# Altium schematic sheet 12_Periphs.SchDoc: Peripherals
size A3; Organization: Lime Microsystems; Address1: Surrey Tech Centre; Address2: Guildford GU2 7YG; Address3: Surrey; Address4: United Kingdom; Revision: SoDeRa-PCI v1.0; SheetNumber: 12; SheetTotal: 15
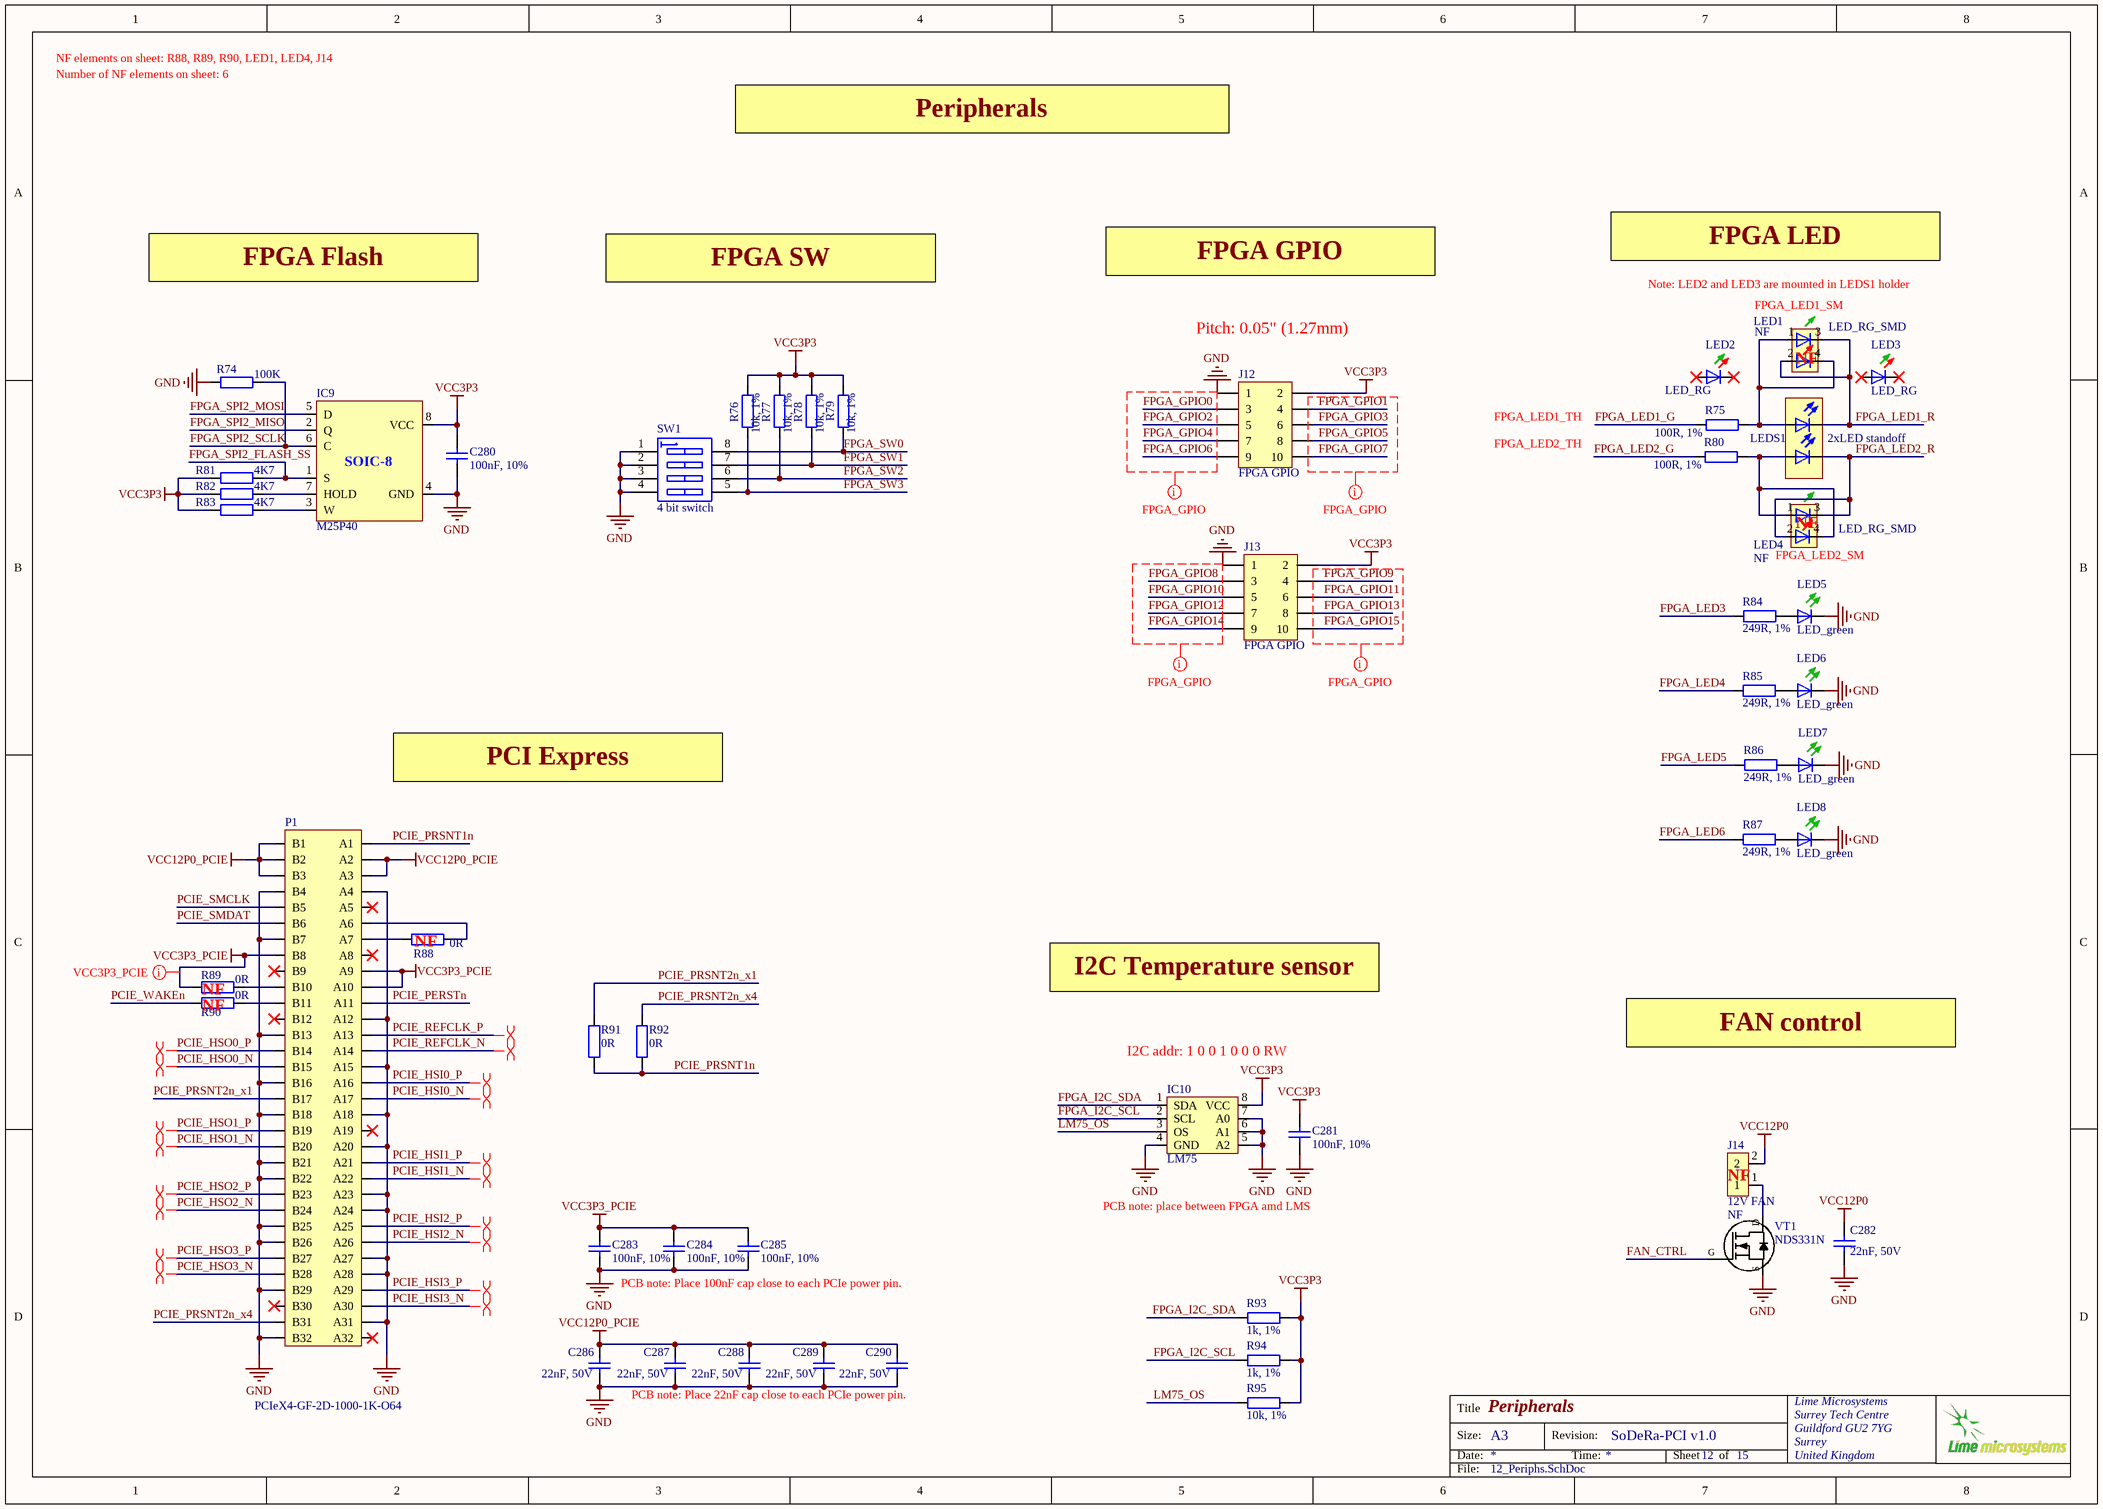
[diagram p0: 12_Periphs.SchDoc]

## Parts
C280  100nF, 10%  [CAP0402]
C281  100nF, 10%  [CAP0402]
C282  22nF, 50V  [CAP0402]
C283  100nF, 10%  [CAP0402]
C284  100nF, 10%  [CAP0402]
C285  100nF, 10%  [CAP0402]
C286  22nF, 50V  [CAP0402]
C287  22nF, 50V  [CAP0402]
C288  22nF, 50V  [CAP0402]
C289  22nF, 50V  [CAP0402]
C290  22nF, 50V  [CAP0402]
IC9  M25P40  [M25P40-VMN6TPB_SO8N]
IC10  LM75  [HWSON8_LM75]
J12  FPGA GPIO  [SWD_10_pin]
J13  FPGA GPIO  [SWD_10_pin]
J14  12V FAN  Assembly Info: NF  [HDR_1x2]
LED1  LED_RG_SMD  Assembly Info: NF  [LED-2x0603]
LED2  LED_RG  (mechanical)
LED3  LED_RG  (mechanical)
LED4  LED_RG_SMD  Assembly Info: NF  [LED-2x0603]
LED5  LED_green  [LED-0603-GREEN]
LED6  LED_green  [LED-0603-GREEN]
LED7  LED_green  [LED-0603-GREEN]
LED8  LED_green  [LED-0603-GREEN]
LEDS1  2xLED standoff  [LED_STANDOFF_H-201C]
P1  PCIeX4-GF-2D-1000-1K-O64  [PCIeX4-GF-2D-1000-1K-O64]  (no BOM)
R74  100K  [RES0402]
R75  100R, 1%  [RES0402]
R76  10k, 1%  [RES0402]
R77  10k, 1%  [RES0402]
R78  10k, 1%  [RES0402]
R79  10k, 1%  [RES0402]
R80  100R, 1%  [RES0402]
R81  4K7  [RES0402]
R82  4K7  [RES0402]
R83  4K7  [RES0402]
R84  249R, 1%  [RES0402]
R85  249R, 1%  [RES0402]
R86  249R, 1%  [RES0402]
R87  249R, 1%  [RES0402]
R88  0R  [RES0402]
R89  0R  [RES0402]
R90  0R  [RES0402]
R91  0R  [RES0402]
R92  0R  [RES0402]
R93  1k, 1%  [RES0402]
R94  1k, 1%  [RES0402]
R95  10k, 1%  [RES0402]
SW1  4 bit switch  [SW_4WAY_SMD_1P27]
VT1  NDS331N  [SOT23-3]

## Nets
GND: C280.2 C281.2 C282.2 C283.2 C284.2 C285.2 C286.2 C287.2 C288.2 C289.2 C290.2 IC9.4(GND) IC10.4(GND) IC10.5(A2) IC10.6(A1) IC10.7(A0) J12.1 J13.1 LED5.K(C) LED6.K(C) LED7.K(C) LED8.K(C) P1.A4 P1.A12 P1.A15 P1.A18 P1.A20 P1.A23 P1.A24 P1.A27 P1.A28 P1.A31 P1.B4 P1.B7 P1.B13 P1.B16 P1.B18 P1.B21 P1.B22 P1.B25 P1.B26 P1.B29 P1.B32 R74.1 SW1.1(A1) SW1.2(A2) SW1.3(A3) SW1.4(A4) VT1.S
VCC3P3: C280.1 C281.1 IC9.8(VCC) IC10.8(VCC) J12.2 J13.2 R76.1 R77.1 R78.1 R79.1 R81.1 R82.1 R83.1 R93.1 R94.1 R95.1
VCC3P3_PCIE: C283.1 C284.1 C285.1 P1.A9 P1.A10 P1.B8 R89.1
VCC12P0: C282.1 J14.2
VCC12P0_PCIE: C286.1 C287.1 C288.1 C289.1 C290.1 P1.A2 P1.A3 P1.B1 P1.B2 P1.B3
FAN_CTRL: VT1.G
FPGA_GPIO0: J12.3
FPGA_GPIO1: J12.4
FPGA_GPIO2: J12.5
FPGA_GPIO3: J12.6
FPGA_GPIO4: J12.7
FPGA_GPIO5: J12.8
FPGA_GPIO6: J12.9
FPGA_GPIO7: J12.10
FPGA_GPIO8: J13.3
FPGA_GPIO9: J13.4
FPGA_GPIO10: J13.5
FPGA_GPIO11: J13.6
FPGA_GPIO12: J13.7
FPGA_GPIO13: J13.8
FPGA_GPIO14: J13.9
FPGA_GPIO15: J13.10
FPGA_I2C_SCL: IC10.2(SCL) R94.2
FPGA_I2C_SDA: IC10.1(SDA) R93.2
FPGA_LED1_G: R75.1
FPGA_LED1_R: LED1.2 LED1.3 LEDS1.K1(C)
FPGA_LED2_G: R80.1
FPGA_LED2_R: LED4.2 LED4.3 LEDS1.K2(C)
FPGA_LED3: R84.1
FPGA_LED4: R85.1
FPGA_LED5: R86.1
FPGA_LED6: R87.1
FPGA_SPI2_FLASH_SS: IC9.1(S) R81.2
FPGA_SPI2_MISO: IC9.2(Q)
FPGA_SPI2_MOSI: IC9.5(D)
FPGA_SPI2_SCLK: IC9.6(C) R74.2
FPGA_SW0: R79.2 SW1.8(B1)
FPGA_SW1: R78.2 SW1.7(B2)
FPGA_SW2: R77.2 SW1.6(B3)
FPGA_SW3: R76.2 SW1.5(B4)
LM75_OS: IC10.3(OS) R95.2
PCIE_HSI0_N: P1.A17
PCIE_HSI0_P: P1.A16
PCIE_HSI1_N: P1.A22
PCIE_HSI1_P: P1.A21
PCIE_HSI2_N: P1.A26
PCIE_HSI2_P: P1.A25
PCIE_HSI3_N: P1.A30
PCIE_HSI3_P: P1.A29
PCIE_HSO0_N: P1.B15
PCIE_HSO0_P: P1.B14
PCIE_HSO1_N: P1.B20
PCIE_HSO1_P: P1.B19
PCIE_HSO2_N: P1.B24
PCIE_HSO2_P: P1.B23
PCIE_HSO3_N: P1.B28
PCIE_HSO3_P: P1.B27
PCIE_PERSTn: P1.A11
PCIE_PRSNT1n: P1.A1 R91.1 R92.1
PCIE_PRSNT2n_x1: P1.B17 R91.2
PCIE_PRSNT2n_x4: P1.B31 R92.2
PCIE_REFCLK_N: P1.A14
PCIE_REFCLK_P: P1.A13
PCIE_SMCLK: P1.B5
PCIE_SMDAT: P1.B6
PCIE_WAKEn: R90.1
NetIC9_3: IC9.3(W) R83.2
NetIC9_7: IC9.7(HOLD) R82.2
NetJ14_1: J14.1 VT1.D
NetLED1_1: LED1.1 LED1.4 LEDS1.A1(A) R75.2
NetLED4_1: LED4.1 LED4.4 LEDS1.A2(A) R80.2
NetLED5_A: LED5.A R84.2
NetLED6_A: LED6.A R85.2
NetLED7_A: LED7.A R86.2
NetLED8_A: LED8.A R87.2
NetP1_A6: P1.A6 R88.2
NetP1_A7: P1.A7 R88.1
NetP1_B10: P1.B10 R89.2
NetP1_B11: P1.B11 R90.2

Not connected (* = marked no-connect by the designer): LED2 A* K(C)*; LED3 A* K(C)*; P1 A5* A8* A19* A32* B9* B12* B30*

## Layout directives
net class FPGA_GPIO: FPGA_GPIO0, FPGA_GPIO1, FPGA_GPIO2, FPGA_GPIO3, FPGA_GPIO4, FPGA_GPIO5, FPGA_GPIO6, FPGA_GPIO7, FPGA_GPIO8, FPGA_GPIO9, FPGA_GPIO10, FPGA_GPIO11, FPGA_GPIO12, FPGA_GPIO13, FPGA_GPIO14, FPGA_GPIO15
differential pair: PCIE_HSI0_N, PCIE_HSI0_P, PCIE_HSI1_N, PCIE_HSI1_P, PCIE_HSI2_N, PCIE_HSI2_P, PCIE_HSI3_N, PCIE_HSI3_P, PCIE_HSO0_N, PCIE_HSO0_P, PCIE_HSO1_N, PCIE_HSO1_P, PCIE_HSO2_N, PCIE_HSO2_P, PCIE_HSO3_N, PCIE_HSO3_P, PCIE_REFCLK_N, PCIE_REFCLK_P
net class VCC3P3_PCIE: VCC3P3_PCIE

## Notes on the sheet
- Number of NF elements on sheet: 6
- NF elements on sheet: R88, R89, R90, LED1, LED4, J14
- Peripherals
- FPGA Flash
- FPGA SW
- FPGA GPIO
- FPGA LED
- (near LED1) Note: LED2 and LED3 are mounted in LEDS1 holder
- (near LED1) FPGA_LED1_SM
- Pitch: 0.05" (1.27mm)
- (near LED1) NF
- FPGA_LED1_TH
- FPGA_LED2_TH
- (near LED4) FPGA_LED2_SM
- (near LED4) NF
- PCI Express
- (near R88) NF
- I2C Temperature sensor
- (near R90) NF
- (near R89) NF
- I2C addr: 1 0 0 1 0 0 0 RW
- FAN control
- (near J14) NF
- PCB note: place between FPGA amd LMS
- PCB note: Place 100nF cap close to each PCIe power pin.
- PCB note: Place 22nF cap close to each PCIe power pin.
- Title
- Size:
- Date:
- A3
- Revision:
- Time:
- Sheet
- of
- File:
- (in symbol M25P40) SOIC-8

## Library data of the parts
C280 C281 = Cap_0603: Manufacturer: Murata; Manufacturer Part Number 1: GRM155R71C104KA88D; Brand: Murata Electronics; Type: General Purpose MLCC; Capacitance: 0.1 uF; Temperature Coefficient / Code: +/- 15 %; Voltage Rating DC: 16 V; Supplier 1: Mouser; Supplier Part Number 1: 81-GRM155R71C104KA88; Tolerance: 10 %; Case Code - in: 0402; Category: Multilayer Ceramic Capacitors MLCC - SMD/SMT; Value: 100nF, 10%; Manufacturer Part Number: GRM155R71C104KA88D
C282 C286-C290 = Cap_0402: Manufacturer: Kemet; Manufacturer Part Number 1: C0402C223K5RACTU; Temperature Coefficient: X7R; Tolerance: ±10%; Capacitance: 0.022µF; Value: 22nF, 50V; Supplier 1: Digi-Key; Supplier Part Number 1: 399-7780-1-ND; Ratings: -; Packaging: Cut Tape (CT); Category: Capacitors; Size / Dimension: 0.039" L x 0.020" W (1.00mm x 0.50mm); RoHS: RoHS Compliant; Operating Temperature: -55°C ~ 125°C; Mounting Type: Surface Mount, MLCC; Applications: General Purpose; Voltage - Rated: 50V; Thickness (Max): 0.022" (0.55mm); Features: -; Height - Seated (Max): -; Lead Style: -; Package / Case: 0402 (1005 Metric); Lead Spacing: -
C283-C285 = Cap_0603: Manufacturer: Murata; Brand: Murata Electronics; Type: General Purpose MLCC; Capacitance: 0.1 uF; Temperature Coefficient / Code: +/- 15 %; Voltage Rating DC: 16 V; Supplier 1: Mouser; Supplier Part Number 1: 81-GRM155R71C104KA88; Tolerance: 10 %; Case Code - in: 0402; Category: Multilayer Ceramic Capacitors MLCC - SMD/SMT; Value: 100nF, 10%
IC9 = M25P40: Manufacturer: Micron Technology Inc; Memory Size: 4M (512K x 8); Voltage - Supply: 2.3 V ~ 3.6 V; Supplier 1: Digi-Key; Supplier Device Package: 8-SO; Supplier: Digi-Key; Supplier Part Number 1: M25P40-VMN6TPBTR-ND
IC10 = LM75: Manufacturer: NXP Semiconductors; Manufacturer Part Number: LM75BTP,147; Sensing Temperature - Local: -55°C ~ 125°C; Output Type: I²C; Accuracy - Highest (Lowest): ±2°C (±3°C); Voltage - Supply: 2.8 V ~ 5.5 V; Test Condition: -25°C ~ 100°C (-55°C ~ 125°C); Sensor Type: Digital, Local; Resolution: 10 b; Supplier 1: Digi-Key; Operating Temperature: -55°C ~ 125°C; Features: Output Switch, Programmable Limit, Shutdown Mode; Supplier Device Package: 8-HWSON (2x3); Sensing Temperature - Remote: -; Category: Sensors, Transducers; Packaging: Tape & Reel (TR); RoHS: RoHS Compliant; Package / Case: 8-WFDFN Exposed Pad; Supplier Part Number 1: 568-9815-2-ND
J12 J13 = Header 5X2_SWD: Header, 5-Pin, Dual row; Manufacturer Part Number 1: M50-3600542; Manufacturer: Harwin Inc; Number of Positions: 10; Molding Height Above Board: 0.039" (1.00mm); Row Spacing: 0.050" (1.27mm); Number of Positions Loaded: All; Connector Type: Unshrouded; Supplier 1: Digi-Key; Contact Mating Length: 0.118" (3.00mm); Category: Connectors, Interconnects; Color: Black; RoHS: RoHS Compliant; Number of Rows: 2; Contact Finish Thickness: 3µin (0.08µm); Height Stacking (Mating): -; Contact Finish: Gold; Termination: Solder; Mounting Type: Surface Mount; Pitch: 0.050" (1.27mm); Features: -; Packaging: Bulk; Supplier Part Number 1: 952-1389-ND
J14 = Jumper: Manufacturer Part Number 1: 961102-6404-AR; Connector Type: Header, Unshrouded; Supplier 1: Digi-Key; Supplier Part Number 1: 3M9447-ND; Contact Type: Male Pin; Color: Black; Mounting Type: Through Hole; Category: Connectors, Interconnects; Contact Finish: Gold
LED1 LED4 = LED_green_red_SMD: Manufacturer Part Number 1: HSMF-C165; Manufacturer: Avago Technologies US Inc.; Millicandela Rating: 15mcd Green, 10mcd Red; Lens Transparency: Diffused; Lens Color: White; Lens Style/Size: Rectangle with Flat Top, 1.60mm x 0.80mm; Wavelength - Peak: 570nm Green, 636nm Red; Wavelength - Dominant: 572nm Green, 621nm Red; Viewing Angle: 120°; Voltage - Forward (Vf) (Typ): 2.2V Green, 1.95V Red; Current - Test: 20mA; Color: Green, Red; Supplier 1: Digi-Key; Height (Max): 0.50mm; Packaging: Cut Tape (CT); Category: Optoelectronics; Mounting Type: Surface Mount; Package / Case: 0603 (1608 Metric); Size / Dimension: 1.60mm L x 0.80mm W; Supplier Device Package: *; RoHS: RoHS Compliant; Supplier Part Number 1: 516-1419-1-ND
LED2 LED3 = LED_green_red: Manufacturer Part Number 1: 4301F1/5; Manufacturer: Visual Communications Company - VCC; Voltage - Forward (Vf) (Typ): 2.1V Green, 1.8V Red; Lens Color: White; Lens Style/Size: Round with Domed Top, 3mm (T-1), 2.90mm; Millicandela Rating: 12.6mcd Green, 3.7mcd Red; Color: Green, Red; Viewing Angle: 100°; Lens Transparency: Diffused; Current - Test: 20mA Green, 20mA Red; Wavelength - Peak: 565nm Green, 660nm Red; Supplier 1: Digi-Key; Supplier Part Number 1: 4301F1/5-ND; RoHS: RoHS Compliant; Packaging: Bulk; Package / Case: Radial; Mounting Type: Through Hole; Wavelength - Dominant: -; Supplier Device Package: T-1; Size / Dimension: -; Category: Optoelectronics; Height (Max): 5.44mm
LED5-LED8 = LED_green: Current - Test: 20mA; Voltage - Forward (Vf) (Typ): 2.2V; Color: Green; Supplier 1: Digi-Key; Supplier Part Number 1: 516-1425-2-ND; Category: Optoelectronics; Package / Case: 0603 (1608 Metric)
LEDS1 = LEDx2_STANDOFF: Manufacturer Part Number 1: H-201C; Manufacturer: Bivar Inc.; LED: T1; Supplier 1: Digi-Key; Supplier Part Number 1: 492-1790-ND; Category: Optoelectronics; RoHS: RoHS Compliant; Color: Black; Length: 0.380" (9.65mm); Material: Nylon
R74 = Res_0402: Manufacturer Part Number 1: ERJ-2GEJ104X; Manufacturer: Panasonic Electronic Components; Tolerance: ±5%; Temperature Coefficient: ±200ppm/°C; Power (Watts): 0.1W, 1/10W; Value: 100K; Supplier 1: Digi-Key; Supplier Part Number 1: P100KJCT-ND; Resistance (Ohms): 100k; Composition: Thick Film; Features: Automotive AEC-Q200; Number of Terminations: 2; Height: 0.016" (0.40mm); RoHS: RoHS Compliant; Package / Case: 0402 (1005 Metric); Packaging: Cut Tape (CT); Size / Dimension: 0.039" L x 0.020" W (1.00mm x 0.50mm); Supplier Device Package: 0402; Operating Temperature: -55°C ~ 155°C; Category: Resistors
R75 R80 = Res_0402: Manufacturer Part Number 1: RMCF0402FT100R; Manufacturer: Stackpole Electronics Inc; Power (Watts): 0.063W, 1/16W; Temperature Coefficient: ±100ppm/°C; Resistance (Ohms): 100; Value: 100R, 1%; Supplier 1: Digi-Key; Supplier Part Number 1: RMCF0402FT100RDKR-ND; Packaging: Digi-Reel®; Composition: Thick Film; Number of Terminations: 2; Package / Case: 0402 (1005 Metric); RoHS: RoHS Compliant; Category: Resistors; Size / Dimension: 0.039" L x 0.020" W (1.00mm x 0.50mm); Tolerance: ±1%; Supplier Device Package: 0402; Features: -; Height: 0.016" (0.40mm); Operating Temperature: -55°C ~ 155°C
R76-R79 R95 = Res_0402: Manufacturer: Yageo; Manufacturer Part Number 1: RC0402FR-0710KL; Temperature Coefficient: ±100ppm/°C; Power (Watts): 0.063W, 1/16W; Value: 10k, 1%; Supplier 1: Digi-Key; Supplier Part Number 1: 311-10.0KLRTR-ND; Resistance (Ohms): 10k; Packaging: Tape & Reel (TR); RoHS: RoHS Compliant; Package / Case: 0402 (1005 Metric); Tolerance: ±1%; Operating Temperature: -55°C ~ 155°C; Size / Dimension: 0.039" L x 0.020" W (1.00mm x 0.50mm); Number of Terminations: 2; Category: Resistors; Height: 0.016" (0.40mm); Supplier Device Package: 0402; Features: Moisture Resistant; Composition: Thick Film
R81-R83 = Res_0402: Manufacturer Part Number 1: RMCF0402JT4K70; Temperature Coefficient: ±100ppm/°C; Resistance(Ohms): 4.7k; Tolerance: ±5%; Supplier 1: Digi-Key; Composition: Thick Film; Supplier Device Package: 0402; Supplier: Digi-Key; Supplier Part Number 1: RMCF0402JT4K70TR-ND; Category: Resistors; Value: 4K7
R84-R87 = Res_0402: Manufacturer Part Number 1: RMCF0402FT249R; Manufacturer: Stackpole Electronics Inc; Resistance (Ohms): 249; Power (Watts): 0.063W, 1/16W; Temperature Coefficient: ±100ppm/°C; Value: 249R, 1%; Supplier 1: Digi-Key; Supplier Part Number 1: RMCF0402FT249RCT-ND; Package / Case: 0402 (1005 Metric); Features: -; Size / Dimension: 0.039" L x 0.020" W (1.00mm x 0.50mm); Category: Resistors; Operating Temperature: -55°C ~ 155°C; Packaging: Cut Tape (CT); Tolerance: ±1%; Supplier Device Package: 0402; RoHS: RoHS Compliant; Composition: Thick Film; Number of Terminations: 2; Height: 0.016" (0.40mm)
R88-R90 = Res_0402: Manufacturer: Yageo; Assembly Info: NF; Supplier 1: Digi-Key; Supplier Part Number 1: 311-0.0JRTR-ND; Composition: Thick Film; Package / Case: 0402 (1005 Metric); Category: Resistors; Value: 0R
R91 R92 = Res_0402: Manufacturer: Yageo; Supplier 1: Digi-Key; Supplier Part Number 1: 311-0.0JRTR-ND; Composition: Thick Film; Package / Case: 0402 (1005 Metric); Category: Resistors; Value: 0R
R93 R94 = Res_0402: Manufacturer: Stackpole Electronics Inc; Manufacturer Part Number 1: RMCF0402FT1K00; Temperature Coefficient: ±100ppm/°C; Power (Watts): 0.063W, 1/16W; Value: 1k, 1%; Supplier 1: Digi-Key; Supplier Part Number 1: RMCF0402FT1K00TR-ND; Package / Case: 0402 (1005 Metric); Supplier Device Package: 0402; Height: 0.016" (0.40mm); Size / Dimension: 0.039" L x 0.020" W (1.00mm x 0.50mm); Number of Terminations: 2; Packaging: Cut Tape (CT); Category: Resistors; Composition: Thick Film; Resistance (Ohms): 1k; Tolerance: ±1%; Features: Moisture Resistant; Operating Temperature: -55°C ~ 155°C; RoHS: RoHS Compliant
SW1 = SW_SM_4bit: Manufacturer Part Number 1: A6H-4101; Manufacturer: Omron Electronics Inc-EMC Div; Pitch: 0.050" (1.27mm), Half; Mechanical Life: 1,000 Cycles; Washable: No; Current Rating: 25mA; Number of Positions: 4; Voltage Rating: 24VDC; Actuator Level: Flush, Recessed; Circuit: SPST; Actuator Type: Slide (Standard); Supplier 1: Digi-Key; Height Above Board: 0.061" (1.55mm); RoHS: RoHS Compliant; Termination Style: Gull Wing; Electrical Life: 1,000 Cycles; Length: 0.248" (6.31mm); Category: Switches; Operating Temperature: -20°C ~ 70°C; Body Material: -; Contact Material: -; Features: -; Mounting Type: Surface Mount; Contact Finish: -; Packaging: Tube; Supplier Part Number 1: SW1080-ND
VT1 = NDS331N: Gate Charge (Qg) @ Vgs: 5nC @ 4.5V; Power - Max: 460mW; Current - Continuous Drain (Id) @ 25°C: 1.3A (Ta); Input Capacitance (Ciss) @ Vds: 162pF @ 10V; FET Type: MOSFET N-Channel, Metal Oxide; Drain to Source Voltage (Vdss): 20V; FET Feature: Logic Level Gate; Supplier Device Package: 3-SSOT; Category: Discrete Semiconductor Products; Mounting Type: Surface Mount; Package / Case: TO-236-3, SC-59, SOT-23-3; Supplier 1: Digi-Key; Supplier Part Number 1: NDS331NCT-ND; Manufacturer Part Number: NDS331N